# Altium project openmv-ae3-r3.PrjPcb (part 2 of 2)

## Sheet processor.SchDoc
size C
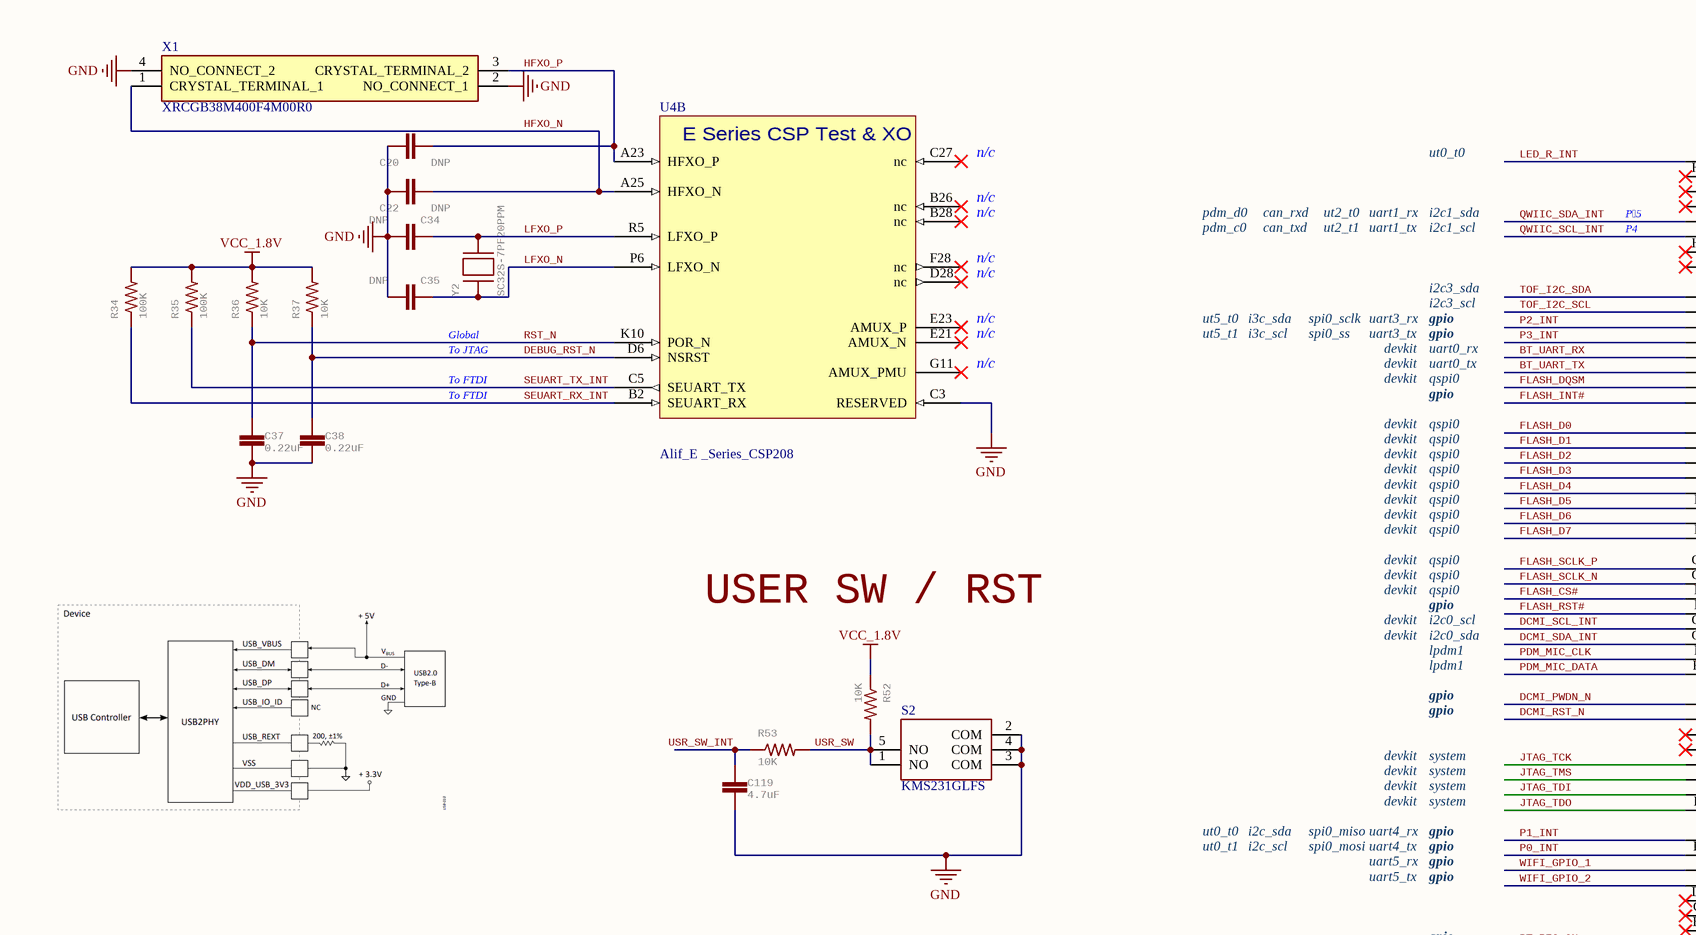
[diagram p9: processor.SchDoc, top left]
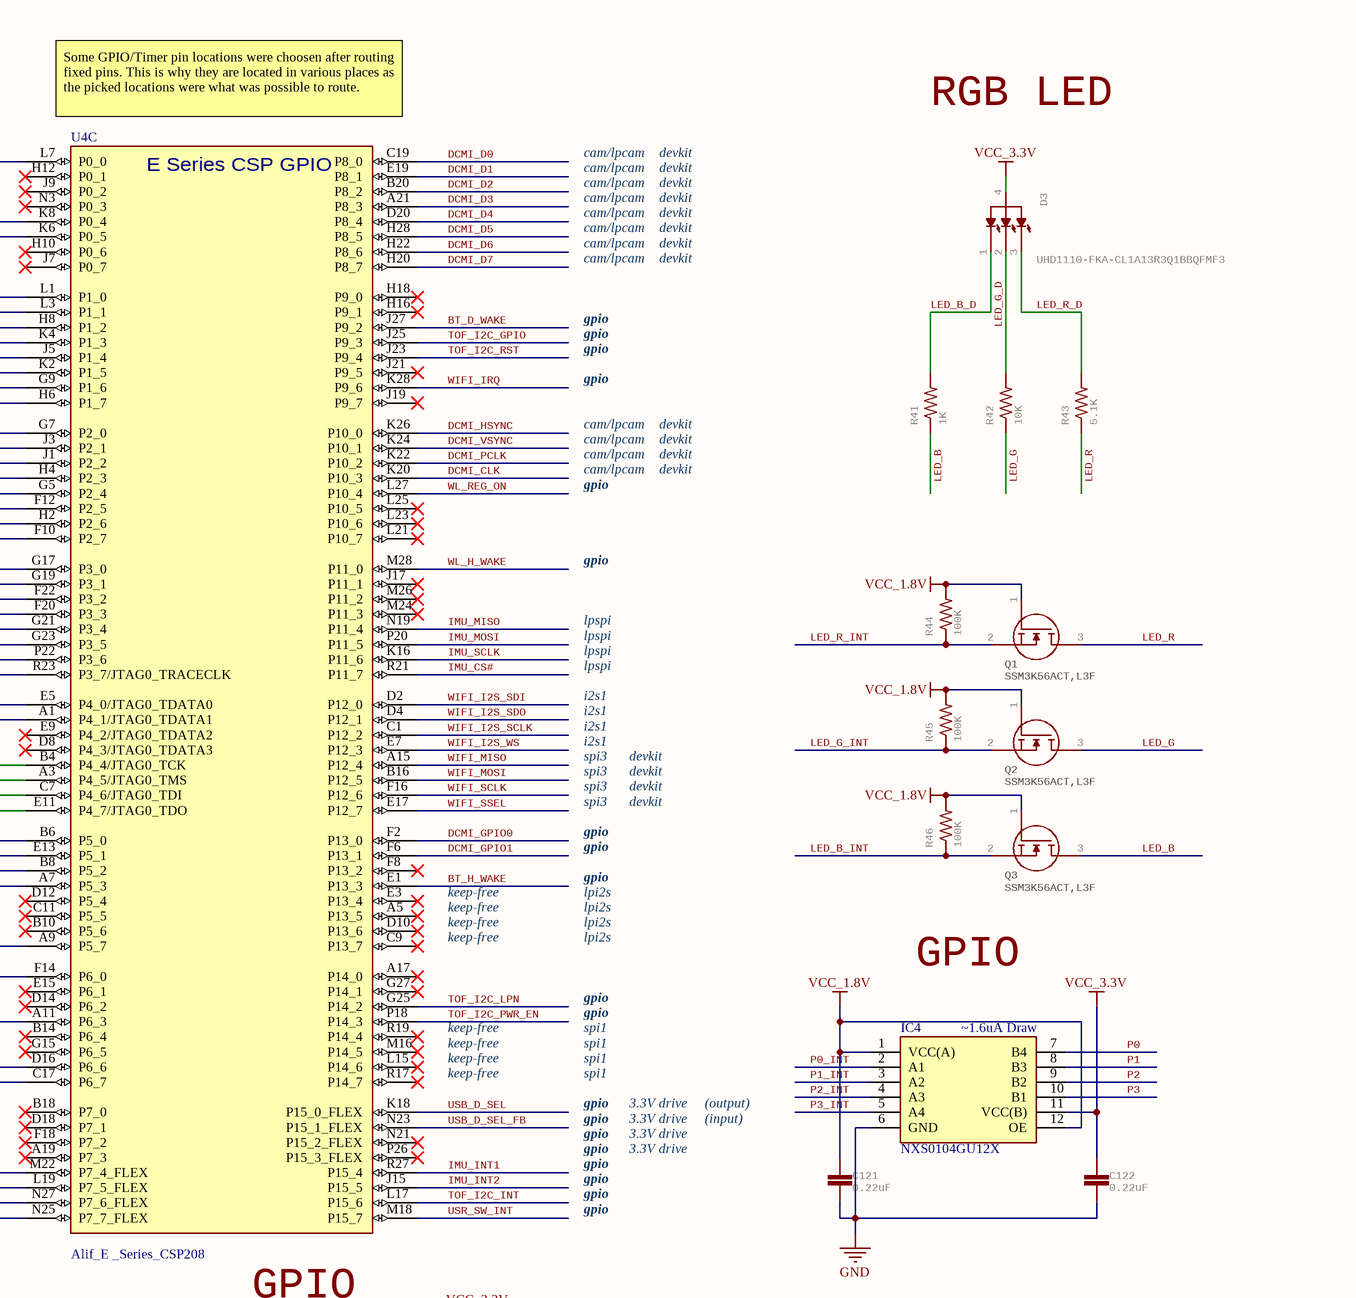
[diagram p10: processor.SchDoc, top right]
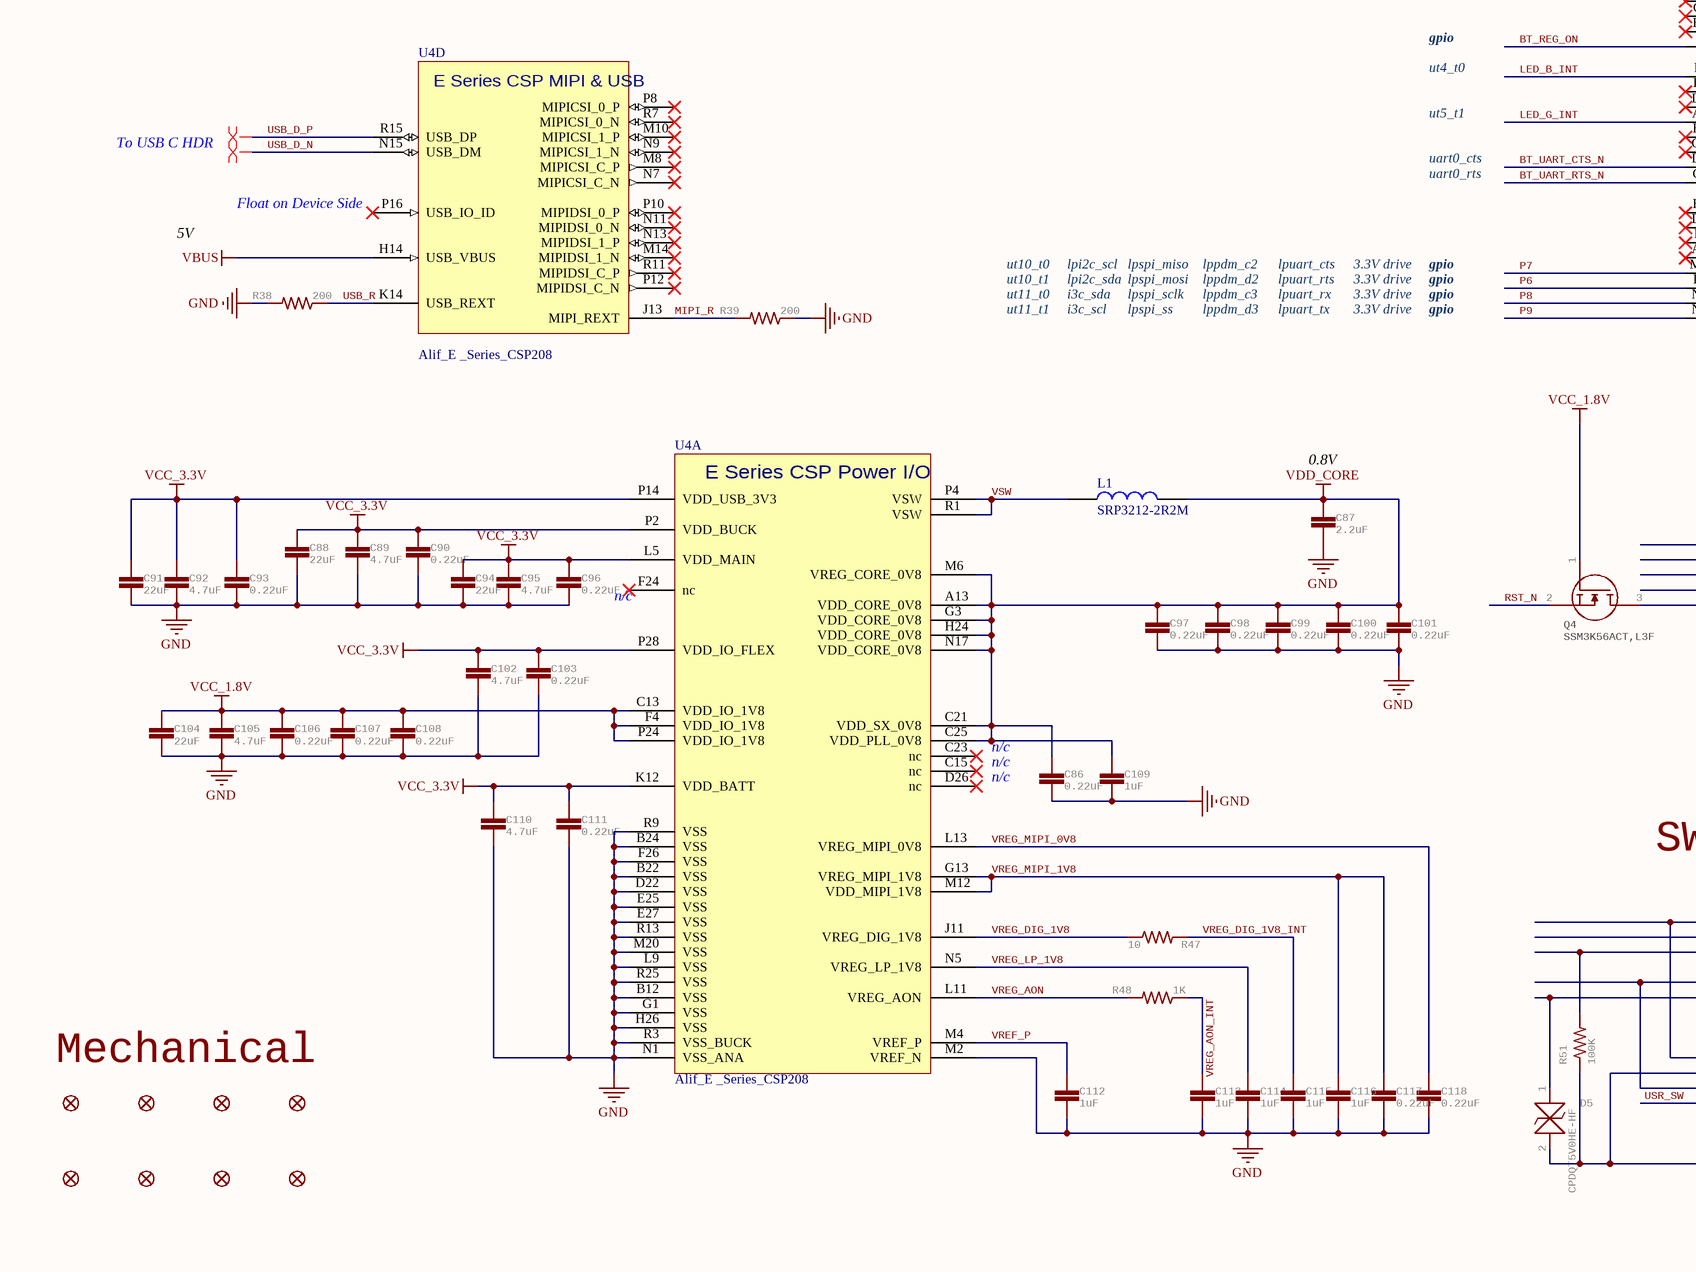
[diagram p11: processor.SchDoc, bottom left]
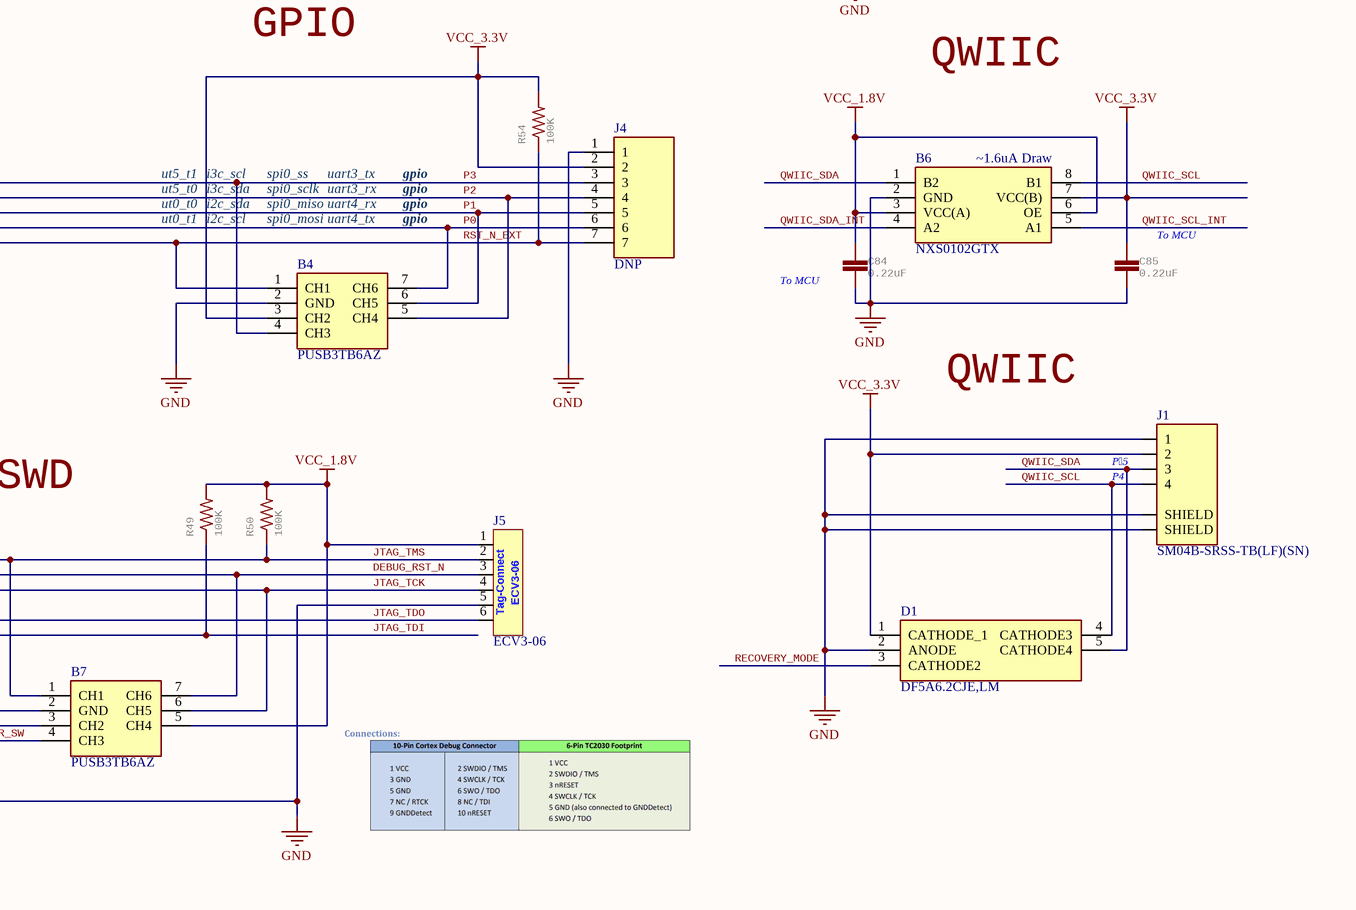
[diagram p12: processor.SchDoc, bottom right]

### Parts
B4  PUSB3TB6AZ  [PUSB3TB6AZ]
B6  NXS0102GTX  [NXS0102GTX]
B7  PUSB3TB6AZ  [PUSB3TB6AZ]
C20  DNP  [C0201]
C22  DNP  [C0201]
C34  DNP  [C0201]
C35  DNP  [C0201]
C37  0.22uF  [C0201]
C38  0.22uF  [C0201]
C84  0.22uF  [C0201]
C85  0.22uF  [C0201]
C86  0.22uF  [C0201]
C87  2.2uF  [0402-CAP]
C88  22uF  [0805]
C89  4.7uF  [0402-CAP]
C90  0.22uF  [C0201]
C91  22uF  [0805]
C92  4.7uF  [0402-CAP]
C93  0.22uF  [C0201]
C94  22uF  [0805]
C95  4.7uF  [0402-CAP]
C96  0.22uF  [C0201]
C97  0.22uF  [C0201]
C98  0.22uF  [C0201]
C99  0.22uF  [C0201]
C100  0.22uF  [C0201]
C101  0.22uF  [C0201]
C102  4.7uF  [0402-CAP]
C103  0.22uF  [C0201]
C104  22uF  [0805]
C105  4.7uF  [0402-CAP]
C106  0.22uF  [C0201]
C107  0.22uF  [C0201]
C108  0.22uF  [C0201]
C109  1uF  [C0201]
C110  4.7uF  [0402-CAP]
C111  0.22uF  [C0201]
C112  1uF  [C0201]
C113  1uF  [C0201]
C114  1uF  [C0201]
C115  1uF  [C0201]
C116  1uF  [C0201]
C117  0.22uF  [C0201]
C118  0.22uF  [C0201]
C119  4.7uF  [0402-CAP]
C121  0.22uF  [C0201]
C122  0.22uF  [C0201]
D1  DF5A6.2CJE,LM  [SOTFL50P160X60-5N]
D3  UHD1110-FKA-CL1A13R3Q1BBQFMF3  [LED_UHD1110-FKA-CL1A13R3Q1BBQFMF3]
D5  CPDQT5V0HE-HF  [CPDQT5V0HEHF]
FD1  FIDUCIAL1X2  [FIDUCIAL-1X2]  (value not drawn)
FD2  FIDUCIAL1X2  [FIDUCIAL-1X2]  (value not drawn)
FD3  FIDUCIAL1X2  [FIDUCIAL-1X2]  (value not drawn)
FD4  FIDUCIAL1X2  [FIDUCIAL-1X2]  (value not drawn)
FD5  FIDUCIAL1X2  [FIDUCIAL-1X2]  (value not drawn)
FD6  FIDUCIAL1X2  [FIDUCIAL-1X2]  (value not drawn)
FD7  FIDUCIAL1X2  [FIDUCIAL-1X2]  (value not drawn)
FD8  FIDUCIAL1X2  [FIDUCIAL-1X2]  (value not drawn)
IC4  NXS0104GU12X  [NXS0104GU12X]
J1  SM04B-SRSS-TB(LF)(SN)  [JST_SM04B-SRSS-TB(LF)(SN)]
J4  DNP  [HDRV7W66P0X254_1X7_1778X254X844P]
J5  ECV3-06  [ECV3-06]  (no BOM)
L1  SRP3212-2R2M  [IND3225X100N]
Q1  MPN: SSM3K56ACT,L3F  [DFN1006]  (hidden comment: NMOS)
Q2  MPN: SSM3K56ACT,L3F  [DFN1006]  (hidden comment: NMOS)
Q3  MPN: SSM3K56ACT,L3F  [DFN1006]  (hidden comment: NMOS)
Q4  MPN: SSM3K56ACT,L3F  [DFN1006]  (hidden comment: NMOS)
R34  100K  [R0201]
R35  100K  [R0201]
R36  10K  [R0201]
R37  10K  [R0201]
R38  200  [R0201]
R39  200  [R0201]
R41  1K  [R0201]
R42  10K  [R0201]
R43  5.1K  [R0201]
R44  100K  [R0201]
R45  100K  [R0201]
R46  100K  [R0201]
R47  10  [R0201]
R48  1K  [R0201]
R49  100K  [R0201]
R50  100K  [R0201]
R51  100K  [R0201]
R52  10K  [R0201]
R53  10K  [R0201]
R54  100K  [R0201]
S2  KMS231GLFS  [KMS231GLFS]
U4  Alif_E _Series_CSP208  [CSP208]  (parts A,B,C,D of 4)
X1  XRCGB38M400F4M00R0  [XTAL_2016]
Y2  SC32S-7PF20PPM  [XTAL_ABS07-32.768KHZ-7-T]

### Nets
GND: B4.2(GND) B6.2(GND) B7.2(GND) C20.1 C22.1 C34.2 C35.2 C37.1 C38.1 C84.1 C85.1 C86.2 C87.2 C88.1 C89.2 C90.1 C91.1 C92.2 C93.1 C94.1 C95.2 C96.1 C97.1 C98.1 C99.1 C100.1 C101.1 C102.2 C103.1 C104.1 C105.2 C106.1 C107.1 C108.1 C109.2 C110.2 C111.1 C112.1 C113.1 C114.1 C115.1 C116.1 C117.1 C118.1 C119.2 C121.1 C122.1 D1.2(ANODE) D5.2 IC4.6(GND) J1.1 J1.S1(SHIELD) J1.S2(SHIELD) J4.1 J5.5 R38.2 R39.1 R51.1 S2.2(COM) S2.3(COM) S2.4(COM) U4.B12(VSS) U4.B22(VSS) U4.B24(VSS) U4.C3(RESERVED) U4.D22(VSS) U4.E25(VSS) U4.E27(VSS) U4.F26(VSS) U4.G1(VSS) U4.H26(VSS) U4.L9(VSS) U4.M2(VREF_N) U4.M20(VSS) U4.N1(VSS_ANA) U4.R3(VSS_BUCK) U4.R9(VSS) U4.R13(VSS) U4.R25(VSS) X1.2(NO_CONNECT_1) X1.4(NO_CONNECT_2)
VBUS: U4.H14(USB_VBUS)
VCC_1.8V: B6.3(VCC(A)) B6.6(OE) B7.5(CH4) C84.2 C104.2 C105.1 C106.2 C107.2 C108.2 C121.2 IC4.1(VCC(A)) IC4.12(OE) J5.1 Q1.1(G) Q2.1(G) Q3.1(G) Q4.1(G) R34.2 R35.2 R36.2 R37.2 R44.2 R45.2 R46.2 R49.2 R50.2 R52.1 U4.C13(VDD_IO_1V8) U4.F4(VDD_IO_1V8) U4.P24(VDD_IO_1V8)
VCC_3.3V: B4.3(CH2) B6.7(VCC(B)) C85.2 C88.2 C89.1 C90.2 C91.2 C92.1 C93.2 C94.2 C95.1 C96.2 C102.1 C103.2 C110.1 C111.2 C122.2 D1.1(CATHODE_1) D3.4(ANODE) IC4.11(VCC(B)) J1.2 J4.2 R54.2 U4.K12(VDD_BATT) U4.L5(VDD_MAIN) U4.P2(VDD_BUCK) U4.P14(VDD_USB_3V3) U4.P28(VDD_IO_FLEX)
VDD_CORE: C86.1 C87.1 C97.2 C98.2 C99.2 C100.2 C101.2 C109.1 L1.2 U4.A13(VDD_CORE_0V8) U4.C21(VDD_SX_0V8) U4.C25(VDD_PLL_0V8) U4.G3(VDD_CORE_0V8) U4.H24(VDD_CORE_0V8) U4.M6(VREG_CORE_0V8) U4.N17(VDD_CORE_0V8)
BT_D_WAKE: U4.J27(P9_2)
BT_H_WAKE: U4.E1(P13_3)
BT_REG_ON: U4.A9(P5_7)
BT_UART_CTS_N: U4.D16(P6_6)
BT_UART_RTS_N: U4.C17(P6_7)
BT_UART_RX: U4.J5(P1_4)
BT_UART_TX: U4.K2(P1_5)
DCMI_CLK: U4.K20(P10_3)
DCMI_D0: U4.C19(P8_0)
DCMI_D1: U4.E19(P8_1)
DCMI_D2: U4.B20(P8_2)
DCMI_D3: U4.A21(P8_3)
DCMI_D4: U4.D20(P8_4)
DCMI_D5: U4.H28(P8_5)
DCMI_D6: U4.H22(P8_6)
DCMI_D7: U4.H20(P8_7)
DCMI_GPIO0: U4.F2(P13_0)
DCMI_GPIO1: U4.F6(P13_1)
DCMI_HSYNC: U4.K26(P10_0)
DCMI_PCLK: U4.K22(P10_2)
DCMI_PWDN_N: U4.E5(P4_0/JTAG0_TDATA0)
DCMI_RST_N: U4.A1(P4_1/JTAG0_TDATA1)
DCMI_SCL_INT: U4.G21(P3_4)
DCMI_SDA_INT: U4.G23(P3_5)
DCMI_VSYNC: U4.K24(P10_1)
DEBUG_RST_N: B7.7(CH6) C38.2 J5.3 R37.1 U4.D6(NSRST)
FLASH_CS#: U4.F22(P3_2)
FLASH_D0: U4.G7(P2_0)
FLASH_D1: U4.J3(P2_1)
FLASH_D2: U4.J1(P2_2)
FLASH_D3: U4.H4(P2_3)
FLASH_D4: U4.G5(P2_4)
FLASH_D5: U4.F12(P2_5)
FLASH_D6: U4.H2(P2_6)
FLASH_D7: U4.F10(P2_7)
FLASH_DQSM: U4.G9(P1_6)
FLASH_INT#: U4.H6(P1_7)
FLASH_RST#: U4.F20(P3_3)
FLASH_SCLK_N: U4.G19(P3_1)
FLASH_SCLK_P: U4.G17(P3_0)
HFXO_N: C22.2 U4.A25(HFXO_N) X1.1(CRYSTAL_TERMINAL_1)
HFXO_P: C20.2 U4.A23(HFXO_P) X1.3(CRYSTAL_TERMINAL_2)
IMU_CS#: U4.R21(P11_7)
IMU_INT1: U4.R27(P15_4)
IMU_INT2: U4.J15(P15_5)
IMU_MISO: U4.N19(P11_4)
IMU_MOSI: U4.P20(P11_5)
IMU_SCLK: U4.K16(P11_6)
JTAG_TCK: B7.6(CH5) J5.4 R51.2 U4.B4(P4_4/JTAG0_TCK)
JTAG_TDI: D5.1 R49.1 U4.C7(P4_6/JTAG0_TDI)
JTAG_TDO: B7.3(CH2) J5.6 U4.E11(P4_7/JTAG0_TDO)
JTAG_TMS: B7.1(CH1) J5.2 R50.1 U4.A3(P4_5/JTAG0_TMS)
LED_B: Q3.3(D) R41.1
LED_B_D: D3.1(BLUE) R41.2
LED_B_INT: Q3.2(S) R46.1 U4.F14(P6_0)
LED_G: Q2.3(D) R42.1
LED_G_D: D3.2(GREEN) R42.2
LED_G_INT: Q2.2(S) R45.1 U4.A11(P6_3)
LED_R: Q1.3(D) R43.1
LED_R_D: D3.3(RED) R43.2
LED_R_INT: Q1.2(S) R44.1 U4.L7(P0_0)
LFXO_N: C35.1 U4.P6(LFXO_N) Y2.1
LFXO_P: C34.1 U4.R5(LFXO_P) Y2.2
MIPI_R: R39.2 U4.J13(MIPI_REXT)
P0: B4.7(CH6) IC4.7(B4) J4.6
P0_INT: IC4.2(A1) U4.E13(P5_1)
P1: B4.6(CH5) IC4.8(B3) J4.5
P1_INT: IC4.3(A2) U4.B6(P5_0)
P2: B4.5(CH4) IC4.9(B2) J4.4
P2_INT: IC4.4(A3) U4.H8(P1_2)
P3: B4.4(CH3) IC4.10(B1) J4.3
P3_INT: IC4.5(A4) U4.K4(P1_3)
P6: U4.L19(P7_5_FLEX)
P7: U4.M22(P7_4_FLEX)
P8: U4.N27(P7_6_FLEX)
P9: U4.N25(P7_7_FLEX)
PDM_MIC_CLK: U4.P22(P3_6)
PDM_MIC_DATA: U4.R23(P3_7/JTAG0_TRACECLK)
QWIIC_SCL: B6.8(B1) D1.4(CATHODE3) J1.4
QWIIC_SCL_INT: B6.5(A1) U4.K6(P0_5)
QWIIC_SDA: B6.1(B2) D1.5(CATHODE4) J1.3
QWIIC_SDA_INT: B6.4(A2) U4.K8(P0_4)
RECOVERY_MODE: D1.3(CATHODE2)
RST_N: C37.2 Q4.2(S) R36.1 U4.K10(POR_N)
RST_N_EXT: B4.1(CH1) J4.7 Q4.3(D) R54.1
SEUART_RX_INT: R34.1 U4.B2(SEUART_RX)
SEUART_TX_INT: R35.1 U4.C5(SEUART_TX)
TOF_I2C_GPIO: U4.J25(P9_3)
TOF_I2C_INT: U4.L17(P15_6)
TOF_I2C_LPN: U4.G25(P14_2)
TOF_I2C_PWR_EN: U4.P18(P14_3)
TOF_I2C_RST: U4.J23(P9_4)
TOF_I2C_SCL: U4.L3(P1_1)
TOF_I2C_SDA: U4.L1(P1_0)
USB_D_N: U4.N15(USB_DM)
USB_D_P: U4.R15(USB_DP)
USB_D_SEL: U4.K18(P15_0_FLEX)
USB_D_SEL_FB: U4.N23(P15_1_FLEX)
USB_R: R38.1 U4.K14(USB_REXT)
USR_SW: B7.4(CH3) R52.2 R53.2 S2.1(NO) S2.5(NO)
USR_SW_INT: C119.1 R53.1 U4.M18(P15_7)
VREF_P: C112.2 U4.M4(VREF_P)
VREG_AON: R48.2 U4.L11(VREG_AON)
VREG_AON_INT: C113.2 R48.1
VREG_DIG_1V8: R47.1 U4.J11(VREG_DIG_1V8)
VREG_DIG_1V8_INT: C115.2 R47.2
VREG_LP_1V8: C114.2 U4.N5(VREG_LP_1V8)
VREG_MIPI_0V8: C118.2 U4.L13(VREG_MIPI_0V8)
VREG_MIPI_1V8: C116.2 C117.2 U4.G13(VREG_MIPI_1V8) U4.M12(VDD_MIPI_1V8)
VSW: L1.1 U4.P4(VSW) U4.R1(VSW)
WIFI_GPIO_1: U4.B8(P5_2)
WIFI_GPIO_2: U4.A7(P5_3)
WIFI_I2S_SCLK: U4.C1(P12_2)
WIFI_I2S_SDI: U4.D2(P12_0)
WIFI_I2S_SDO: U4.D4(P12_1)
WIFI_I2S_WS: U4.E7(P12_3)
WIFI_IRQ: U4.K28(P9_6)
WIFI_MISO: U4.A15(P12_4)
WIFI_MOSI: U4.B16(P12_5)
WIFI_SCLK: U4.F16(P12_6)
WIFI_SSEL: U4.E17(P12_7)
WL_H_WAKE: U4.M28(P11_0)
WL_REG_ON: U4.L27(P10_4)

Not connected (* = marked no-connect by the designer): U4 A5(P13_5)* A17(P14_0)* A19(P7_3)* B10(P5_6)* B14(P6_4)* B18(P7_0)* B26(nc)* B28(nc)* C9(P13_7)* C11(P5_5)* C15(nc)* C23(nc)* C27(nc)* D8(P4_3/JTAG0_TDATA3)* D10(P13_6)* D12(P5_4)* D14(P6_2)* D18(P7_1)* D26(nc)* D28(nc)* E3(P13_4)* E9(P4_2/JTAG0_TDATA2)* E15(P6_1)* E21(AMUX_N)* E23(AMUX_P)* F8(P13_2)* F18(P7_2)* F24(nc)* F28(nc)* G11(AMUX_PMU)* G15(P6_5)* G27(P14_1)* H10(P0_6)* H12(P0_1)* H16(P9_1)* H18(P9_0)* J7(P0_7)* J9(P0_2)* J17(P11_1)* J19(P9_7)* J21(P9_5)* L15(P14_6)* L21(P10_7)* L23(P10_6)* L25(P10_5)* M8(MIPICSI_C_P)* M10(MIPICSI_1_P)* M14(MIPIDSI_1_N)* M16(P14_5)* M24(P11_3)* M26(P11_2)* N3(P0_3)* N7(MIPICSI_C_N)* N9(MIPICSI_1_N)* N11(MIPIDSI_0_N)* N13(MIPIDSI_1_P)* N21(P15_2_FLEX)* P8(MIPICSI_0_P)* P10(MIPIDSI_0_P)* P12(MIPIDSI_C_N)* P16(USB_IO_ID)* P26(P15_3_FLEX)* R7(MIPICSI_0_N)* R11(MIPIDSI_C_P)* R17(P14_7)* R19(P14_4)*

### Layout directives
differential pair; differential pair class USB: USB_D_N, USB_D_P

### Notes on the sheet
- (near U4) Some GPIO/Timer pin locations were choosen after routing fixed pins. This is why they are located in various places as the picked locations were what was possible to route.
- RGB LED
- n/c
- ut0_t0
- cam/lpcam
- devkit
- pdm_d0
- pdm_c0
- can_rxd
- can_txd
- ut2_t0
- ut2_t1
- uart1_tx
- uart1_rx
- i2c1_scl
- i2c1_sda
- P5
- P4
- Global
- ut5_t1
- ut5_t0
- i3c_scl
- i3c_sda
- spi0_ss
- spi0_sclk
- uart3_tx
- uart3_rx
- i2c3_scl
- i2c3_sda
- gpio
- To JTAG
- To FTDI
- uart0_rx
- uart0_tx
- qspi0
- USER SW / RST
- i2c0_scl
- i2c0_sda
- lpspi
- lpdm1
- i2s1
- system
- spi3
- ut0_t1
- i2c_sda
- i2c_scl
- spi0_mosi
- spi0_miso
- uart5_rx
- uart4_tx
- uart4_rx
- uart5_tx
- keep-free
- lpi2s
- ut4_t0
- GPIO
- To USB C HDR
- uart0_cts
- uart0_rts
- spi1
- (near IC4) ~1.6uA Draw
- 5V
- (near U4) Float on Device Side
- ut10_t0
- lpi2c_scl
- lpspi_miso
- lppdm_c2
- lpuart_cts
- 3.3V drive
- (output)
- (input)
- ut10_t1
- ut11_t0
- ut11_t1
- lpi2c_sda
- lpspi_mosi
- lpspi_sclk
- lpspi_ss
- lppdm_d2
- lppdm_c3
- lppdm_d3
- lpuart_rts
- lpuart_rx
- lpuart_tx
- (near U4) GPIO
- (near C87) 0.8V
- QWIIC
- (near B6) ~1.6uA Draw
- (near C84) To MCU
- (near C85) To MCU
- SWD
- (near J1) P4
- (near J1) P5
- Mechanical
- (in symbol E7_B0_CSP_208, part A) E Series CSP Power I/O
- (in symbol E7_B0_CSP_208, part B) E Series CSP Test & XO
- (in symbol E7_B0_CSP_208, part C) E Series CSP GPIO
- (in symbol E7_B0_CSP_208, part D) E Series CSP MIPI & USB
- (in symbol ECV3-06) Tag-Connect

### Library data of the parts
B4 B7 = PUSB3TB6AZ: NEXPERIA - PUSB3TB6AZ - DIODE, ESD PROTECTION, 5.5V, 0.27PF; Geometry.Height: 0.5mm; Mouser Part Number: 771-PUSB3TB6AZ; Mouser Price/Stock: https://www.mouser.co.uk/ProductDetail/Nexperia/PUSB3TB6AZ?qs=K2OaAKmNuLgsAI4MRas6Xw%3D%3D; Manufacturer_Name: Nexperia; Manufacturer_Part_Number: PUSB3TB6AZ; Datasheet Link: https://assets.nexperia.com/documents/data-sheet/PUSB3TB6.pdf; Part Number: PUSB3TB6AZ; MPN: PUSB3TB6AZ
B6 = NXS0102GTX: Dual supply translating transceiver; open drain; auto direction sensing; Manufacturer_Name: Nexperia; Geometry.Height: 0.5mm; Mouser Part Number: 771-NXS0102GTX; Mouser Price/Stock: https://www.mouser.co.uk/ProductDetail/Nexperia/NXS0102GTX?qs=GBLSl2AkirukzzJX55VgJA%3D%3D; Manufacturer_Part_Number: NXS0102GTX; Datasheet Link: https://assets.nexperia.com/documents/data-sheet/NXS0102.pdf; MPN: NXS0102GTX; Part Number: NXS0102GTX
C20 C22 C34 C35 = C-EUC0201: CAPACITOR, European symbol; GateName_1: G$1; SymbolName_1: C-EU; POPULARITY: 0; DeviceName: C0201; LibraryName: rcl; DeviceSetName: C-EU; MPN: DNP; SPICEPREFIX: C; Part Number: DNP
C37 C38 C84-C86 C90 C93 C96-C101 C103 C106-C108 C111 C117 C118 C121 C122 = C-EUC0201: CAPACITOR, European symbol; MPN: GRM033R60J224ME15D; GateName_1: G$1; SymbolName_1: C-EU; POPULARITY: 0; DeviceName: C0201; LibraryName: rcl; DeviceSetName: C-EU; SPICEPREFIX: C; Part Number: GRM033R60J224ME15D
C87 = CAP0402-CAP: CapacitorStandard 0603 ceramic capacitor, and 0.1" leaded capacitor.; MPN: CL05A225MQ5NNNC; GateName_1: G$1; SymbolName_1: CAP; DeviceName: 0402-CAP; LibraryName: sfe; DeviceSetName: CAP; Part Number: CL05A225MQ5NNNC
C88 C91 C94 C104 = 22UF-0805-6.3V-20%: 22ÂµF ceramic capacitors    A capacitor is a passive two-terminal electrical component used to store electrical energy temporarily in an electric field.; MPN: CL21A226MQQNNNE; GateName_1: G$1; SymbolName_1: CAP; PROD_ID: CAP-08402; DeviceName: -0805-6.3V-20%; LibraryName: SparkFun-Capacitors; DeviceSetName: 22UF; Part Number: CL21A226MQQNNNE
C89 C92 C95 C102 C105 C110 C119 = CAP0402-CAP: CapacitorStandard 0603 ceramic capacitor, and 0.1" leaded capacitor.; MPN: JMK105BBJ475MV-F; GateName_1: G$1; SymbolName_1: CAP; DeviceName: 0402-CAP; LibraryName: sfe; DeviceSetName: CAP; Part Number: JMK105BBJ475MV-F
C109 C112-C116 = C-EUC0201: CAPACITOR, European symbol; MPN: CL03A105MQ3CSNC; GateName_1: G$1; SymbolName_1: C-EU; POPULARITY: 0; DeviceName: C0201; LibraryName: rcl; DeviceSetName: C-EU; SPICEPREFIX: C; Part Number: CL03A105MQ3CSNC
D1 = DF5A5.6CJE,LM: Diode; Manufacturer_Name: Toshiba; Height: 0.6mm; Manufacturer_Part_Number: DF5A6.2CJE,LM; Mouser Part Number: 757-DF5A6.2CJE,LM; Arrow Part Number: DF5A6.2CJE,LM; MPN: DF5A6.2CJE,LM; Part Number: DF5A6.2CJE,LM
D3 = UHD1110-FKA-CL1A13R3Q1BBQFMF3: LED RGB SMD, SIZE 1 X 1 mm Check availability; GateName_1: G$1; MF: Cree Inc.; SymbolName_1: UHD1110-FKA-CL1A13R3Q1BBQFMF3; LibraryName: UHD1110-FKA-CL1A13R3Q1BBQFMF3; DeviceSetName: UHD1110-FKA-CL1A13R3Q1BBQFMF3; AVAILABILITY: In Stock; MP: UHD1110-FKA-CL1A13R3Q1BBQFMF3; MPN: UHD1110-FKA-CL1A13r3q1BBQFMF3; PACKAGE: 0404 Cree Inc.; PRICE: None; PURCHASE-URL: https://pricing.snapeda.com/search/part/UHD1110-FKA-CL1A13R3Q1BBQFMF3/?ref=eda; Part Number: UHD1110-FKA-CL1A13r3q1BBQFMF3
D5 = CPDQT5V0HE-HF: ESD Suppressors / TVS Diodes DIODE ESD 5VWM 65W 0402/SOD-923F   Source:  Datasheet; MANUFACTURER_NAME: Comchip Technology; GateName_1: G$1; SymbolName_1: CPDQT5V0HE-HF; LibraryName: CPDQT5V0HE-HF; DeviceSetName: CPDQT5V0HE-HF; HEIGHT: 0.42mm; MANUFACTURER_PART_NUMBER: CPDQT5V0HE-HF; MOUSER_PART_NUMBER: MOUSER_PART_NUMBER; MOUSER_PRICE-STOCK: MOUSER_PRICE-STOCK; MPN: CPDQT5V0HE-HF; Part Number: CPDQT5V0HE-HF
FD1-FD8 = FIDUCIAL1X2: Fiducial Alignment Points    Point-of-reference for pick-and-place machines and other optical instruments.; GateName_1: G$1; DeviceName: 1X2; SymbolName_1: FIDUCIAL; LibraryName: SparkFun-Aesthetics; DeviceSetName: FIDUCIAL
IC4 = NXS0104GU12X: Integrated Circuit; Manufacturer_Name: Nexperia; Datasheet Link: https://assets.nexperia.com/documents/data-sheet/NXS0104.pdf; Height: 0.5mm; Manufacturer_Part_Number: NXS0104GU12X; Mouser Part Number: 771-NXS0104GU12X; Mouser Price/Stock: https://www.mouser.co.uk/ProductDetail/Nexperia/NXS0104GU12X?qs=vLWxofP3U2wjXG0CJIIyyA%3D%3D; Arrow Part Number: NXS0104GU12X; Arrow Price/Stock: https://www.arrow.com/en/products/nxs0104gu12x/nexperia?region=nac; Part Number: NXS0104GU12X; MPN: NXS0104GU12X
J1 = CMP-026-000000-1: SH Series 1.0 mm Pitch 2 Position Single Row Side Entry Shrouded Header; Availability: Unavailable; Value: *; Design Item ID: SM04B-SRSS-TB(LF)(SN); Source: SM04B-SRSS-TB(LF)(SN).SchLib; MP: SM04B-SRSS-TB(LF)(SN); Component Type: Standard; Package: None; Pin Count: 6; Price: None; Part Number: SM04B-SRSS-TB(LF)(SN); MPN: SM04B-SRSS-TB(LF)(SN)
J4 = M20-9770746: Connector; Manufacturer_Name: Harwin; Datasheet Link: https://cdn.harwin.com/pdfs/M20-977.pdf; Height: 8.44mm; Manufacturer_Part_Number: M20-9770746; Mouser Part Number: 855-M20-9770746; Mouser Price/Stock: https://www.mouser.co.uk/ProductDetail/Harwin/M20-9770746?qs=Jph8NoUxIfW4IDi91nhySw%3D%3D; MPN: DNP; Part Number: DNP
J5 = ECV3-06: Tag-Connect Edge-Connect ECV3-06 No-Solder Debug Castellated Pads Connector DO NOT PLACE NO BOM
L1 = SRP3212-2R2M: Ind,3.2x2.5x1mm,2.2uH?20%,4A,shd; Manufacturer_Name: Bourns; Geometry.Height: 1mm; Mouser Part Number: 652-SRP3212-2R2M; Mouser Price/Stock: https://www.mouser.co.uk/ProductDetail/Bourns/SRP3212-2R2M?qs=t7xnP681wgW9NT%2FfJNx1CA%3D%3D; Manufacturer_Part_Number: SRP3212-2R2M; Datasheet Link: https://www.bourns.com/pdfs/CVH.pdf; Part Number: SRP3212-2R2M; MPN: SRP3212-2R2M
R34 R35 R44-R46 R49-R51 R54 = RESISTOR0402-RES: MPN: RMCF0201FT100K; GateName_1: G$1; SymbolName_1: RESISTOR; LibraryName: sfe; DeviceSetName: RESISTOR; Part Number: RMCF0201FT100K
R36 R37 R52 R53 = RESISTOR0402-RES: MPN: RMCF0201FT10K0; GateName_1: G$1; SymbolName_1: RESISTOR; LibraryName: sfe; DeviceSetName: RESISTOR; Part Number: RMCF0201FT10K0
R38 R39 = RESISTOR0402-RES: MPN: CR0201-FW-2000GLF; GateName_1: G$1; SymbolName_1: RESISTOR; LibraryName: sfe; DeviceSetName: RESISTOR; Part Number: CR0201-FW-2000GLF
R41 = RESISTOR0402-RES: ResistorBasic schematic elements and footprints for 0603, 1206, and PTH resistors.; MPN: RMCF0201FT1K00; GateName_1: G$1; SymbolName_1: RESISTOR; LibraryName: sfe; DeviceSetName: RESISTOR; Part Number: RMCF0201FT1K00
R42 = RESISTOR0402-RES: ResistorBasic schematic elements and footprints for 0603, 1206, and PTH resistors.; MPN: RMCF0201FT10K0; GateName_1: G$1; SymbolName_1: RESISTOR; LibraryName: sfe; DeviceSetName: RESISTOR; Part Number: RMCF0201FT10K0
R43 = RESISTOR0402-RES: ResistorBasic schematic elements and footprints for 0603, 1206, and PTH resistors.; MPN: AC0201FR-075K1L; GateName_1: G$1; SymbolName_1: RESISTOR; LibraryName: sfe; DeviceSetName: RESISTOR; Part Number: AC0201FR-075K1L
R47 = RESISTOR0402-RES: MPN: RMCF0201JT10R0; GateName_1: G$1; SymbolName_1: RESISTOR; LibraryName: sfe; DeviceSetName: RESISTOR; Part Number: RMCF0201JT10R0
R48 = RESISTOR0402-RES: MPN: RMCF0201FT1K00; GateName_1: G$1; SymbolName_1: RESISTOR; LibraryName: sfe; DeviceSetName: RESISTOR; Part Number: RMCF0201FT1K00
U4 = E7_B0_CSP_208: IC,Alif E7 MCU, Rev B silicon,CSP208; Manufacturer 1: Alif Semi; Manufacturer Part Number 1: AE722F80F55D5AS
X1 = XRCGB38M400F4M00R0: 2.0X1.6X0.65MM 38.4MHZ CRYSTAL; Manufacturer_Name: Murata Electronics; Geometry.Height: 0.7mm; Mouser Part Number: *; Mouser Price/Stock: *; Manufacturer_Part_Number: XRCGB38M400F4M00R0; Datasheet Link: http://www.murata.com/products/productdata/8801066811422/SPEC-XRCGB38M400F4M00R0.pdf; Part Number: XRCGB38M400F4M00R0; MPN: XRCGB38M400F4M00R0
Y2 = ABS07-32.768KHZ-7-T: Check availability; GateName_1: G$1; MF: Abracon; SymbolName_1: ABS07-32.768KHZ-7-T; LibraryName: ABS07-32.768KHZ-7-T; DeviceSetName: ABS07-32.768KHZ-7-T; AVAILABILITY: In Stock; MP: ABS07-32.768KHZ-7-T; MPN: SC32S-7PF20PPM; PACKAGE: SMD-2 Abracon LLC; PRICE: None; PURCHASE-URL: https://pricing.snapeda.com/search/part/ABS07-32.768KHZ-7-T/?ref=eda; Part Number: SC32S-7PF20PPM
Q1-Q4 = NMOS: Part Number: SSM3K56ACT,L3F
S2 = KMS231GLFS: Part Number: KMS231GLFS; MPN: KMS231GLFS

## Nets that join several sheets
GND: usb (33 pins), wifi-bt (28 pins), flash (8 pins), imu (5 pins), camera (37 pins), tof (12 pins), mic (C76.2 C77.1 IC3.2 IC3.3), regulators (29 pins), b2b (7 pins), processor (81 pins)
VBUS: usb (L7.2), regulators (B2.1 B2.6 C64.1), processor (U4.H14)
VCC_1.2V_CAM: camera (14 pins), regulators (C71.1 C73.2 L10.2 R24.2)
VCC_1.8V: usb (5 pins), wifi-bt (6 pins), flash (12 pins), imu (11 pins), camera (R57.2 R58.2), mic (C76.1 C77.2 IC3.5), regulators (8 pins), b2b (J6.1), processor (30 pins)
VCC_1.8V_CAM: camera (12 pins), regulators (C10.2 U9.A1)
VCC_1.8V_TOF: tof (7 pins), regulators (C125.2 U10.A1)
VCC_2.8V_CAM: camera (6 pins), regulators (C72.2 U8.1)
VCC_2.8V_TOF: tof (5 pins), regulators (C120.2 U3.1)
VCC_3.3V: usb (C54.1 C55.2 U5.9), wifi-bt (6 pins), regulators (12 pins), b2b (J6.15), processor (28 pins)
VCC_3.3V_INT: usb (10 pins), regulators (6 pins)
BT_D_WAKE: wifi-bt (IC1.39), processor (U4.J27)
BT_H_WAKE: wifi-bt (IC1.38 R7.2), processor (U4.E1)
BT_REG_ON: wifi-bt (IC1.14), processor (U4.A9)
BT_UART_CTS_N: wifi-bt (IC1.5), processor (U4.D16)
BT_UART_RTS_N: wifi-bt (IC1.4), processor (U4.C17)
BT_UART_RX: wifi-bt (IC1.3), processor (U4.J5)
BT_UART_TX: wifi-bt (IC1.2), processor (U4.K2)
DCMI_CLK: camera (U1.C1), processor (U4.K20)
DCMI_D0: camera (U1.B5), processor (U4.C19)
DCMI_D1: camera (U1.D5), processor (U4.E19)
DCMI_D2: camera (U1.B2), processor (U4.B20)
DCMI_D3: camera (U1.A2), processor (U4.A21)
DCMI_D4: camera (U1.D3), processor (U4.D20)
DCMI_D5: camera (U1.C3), processor (U4.H28)
DCMI_D6: camera (U1.A3), processor (U4.H22)
DCMI_D7: camera (U1.B3), processor (U4.H20)
DCMI_GPIO0: camera (U1.E5), processor (U4.F2)
DCMI_GPIO1: camera (U1.E7), processor (U4.F6)
DCMI_HSYNC: camera (U1.A6), processor (U4.K26)
DCMI_PCLK: camera (U1.C4), processor (U4.K22)
DCMI_PWDN_N: regulators (B1.1 U8.3 U9.B2), processor (U4.E5)
DCMI_RST_N: camera (R5.2 U1.H3), processor (U4.A1)
DCMI_SCL_INT: camera (Q8.3 R58.1), processor (U4.G21)
DCMI_SDA_INT: camera (Q7.3 R57.1), processor (U4.G23)
DCMI_VSYNC: camera (U1.E4), processor (U4.K24)
DEBUG_RST_N: b2b (J6.11), processor (5 pins)
FLASH_CS#: flash (R11.1 U2.C2), processor (U4.F22)
FLASH_D0: flash (U2.D3), processor (U4.G7)
FLASH_D1: flash (U2.D2), processor (U4.J3)
FLASH_D2: flash (U2.C4), processor (U4.J1)
FLASH_D3: flash (U2.D4), processor (U4.H4)
FLASH_D4: flash (U2.D5), processor (U4.G5)
FLASH_D5: flash (U2.E3), processor (U4.F12)
FLASH_D6: flash (U2.E2), processor (U4.H2)
FLASH_D7: flash (U2.E1), processor (U4.F10)
FLASH_DQSM: flash (U2.C3), processor (U4.G9)
FLASH_INT#: flash (R9.1 U2.A5), processor (U4.H6)
FLASH_RST#: flash (U2.A4), processor (U4.F20)
FLASH_SCLK_N: flash (U2.B1), processor (U4.G19)
FLASH_SCLK_P: flash (U2.B2), processor (U4.G17)
IMU_CS#: imu (R1.1 U7.12), processor (U4.R21)
IMU_INT1: imu (U7.4), processor (U4.R27)
IMU_INT2: imu (U7.9), processor (U4.J15)
IMU_MISO: imu (R40.1 U7.1), processor (U4.N19)
IMU_MOSI: imu (R33.1 U7.14), processor (U4.P20)
IMU_SCLK: imu (R2.1 U7.13), processor (U4.K16)
JTAG_TCK: b2b (J6.3), processor (B7.6 J5.4 R51.2 U4.B4)
JTAG_TDI: b2b (J6.7), processor (D5.1 R49.1 U4.C7)
JTAG_TDO: b2b (J6.9), processor (B7.3 J5.6 U4.E11)
JTAG_TMS: b2b (J6.5), processor (B7.1 J5.2 R50.1 U4.A3)
P0: b2b (J6.2), processor (B4.7 IC4.7 J4.6)
P1: b2b (J6.4), processor (B4.6 IC4.8 J4.5)
P2: b2b (J6.6), processor (B4.5 IC4.9 J4.4)
P3: b2b (J6.8), processor (B4.4 IC4.10 J4.3)
P6: b2b (D6.1 J6.14), processor (U4.L19)
P7: b2b (D6.3 J6.16), processor (U4.M22)
P8: b2b (D6.4 J6.18), processor (U4.N27)
P9: b2b (D6.5 J6.20), processor (U4.N25)
PDM_MIC_CLK: mic (IC3.4), processor (U4.P22)
PDM_MIC_DATA: mic (IC3.1), processor (U4.R23)
QWIIC_SCL: b2b (J6.10), processor (B6.8 D1.4 J1.4)
QWIIC_SDA: b2b (J6.12), processor (B6.1 D1.5 J1.3)
RECOVERY_MODE: usb (Q5.1 Q6.1 R56.2 S1.2), processor (D1.3)
RST_N: usb (Q6.3), processor (C37.2 Q4.2 R36.1 U4.K10)
RST_N_EXT: b2b (J6.17), processor (B4.1 J4.7 Q4.3 R54.1)
SEUART_RX_INT: usb (B5.4), processor (R34.1 U4.B2)
SEUART_TX_INT: usb (B5.5), processor (R35.1 U4.C5)
TOF_I2C_GPIO: tof (IC2.C2 R28.1), processor (U4.J25)
TOF_I2C_INT: tof (IC2.A3 R26.1), processor (U4.L17)
TOF_I2C_LPN: tof (IC2.A5 R27.1), processor (U4.G25)
TOF_I2C_PWR_EN: regulators (U3.3 U10.B2), processor (U4.P18)
TOF_I2C_RST: tof (IC2.A1 IC2.A8 R31.2), processor (U4.J23)
TOF_I2C_SCL: tof (IC2.C4 R30.1), processor (U4.L3)
TOF_I2C_SDA: tof (IC2.C3 R29.1), processor (U4.L1)
USB_D_N: usb (U5.6), processor (U4.N15)
USB_D_P: usb (U5.7), processor (U4.R15)
USB_D_SEL: usb (R18.1), processor (U4.K18)
USB_D_SEL_FB: usb (Q5.3 R18.2 R19.2 U5.10), processor (U4.N23)
USR_SW: usb (Q6.2), processor (5 pins)
WIFI_GPIO_1: wifi-bt (IC1.18), processor (U4.B8)
WIFI_GPIO_2: wifi-bt (IC1.17), processor (U4.A7)
WIFI_I2S_SCLK: wifi-bt (IC1.11), processor (U4.C1)
WIFI_I2S_SDI: wifi-bt (IC1.10), processor (U4.D2)
WIFI_I2S_SDO: wifi-bt (IC1.9), processor (U4.D4)
WIFI_I2S_WS: wifi-bt (IC1.8), processor (U4.E7)
WIFI_IRQ: wifi-bt (IC1.26), processor (U4.K28)
WIFI_MISO: wifi-bt (IC1.24), processor (U4.A15)
WIFI_MOSI: wifi-bt (IC1.22), processor (U4.B16)
WIFI_SCLK: wifi-bt (IC1.20), processor (U4.F16)
WIFI_SSEL: wifi-bt (IC1.25 R13.2), processor (U4.E17)
WL_H_WAKE: wifi-bt (IC1.27 R6.1), processor (U4.M28)
WL_REG_ON: wifi-bt (IC1.28), processor (U4.L27)